# EasyEDA schematic SCH_Orto-Idroponico_2021-09-24.json
TITLE: Orto Idroponico; REV: 2.0; Date: 2021-09-23; Sheet: 1/1; Drawn By: francesco-scar; Company: Fablab Imperia
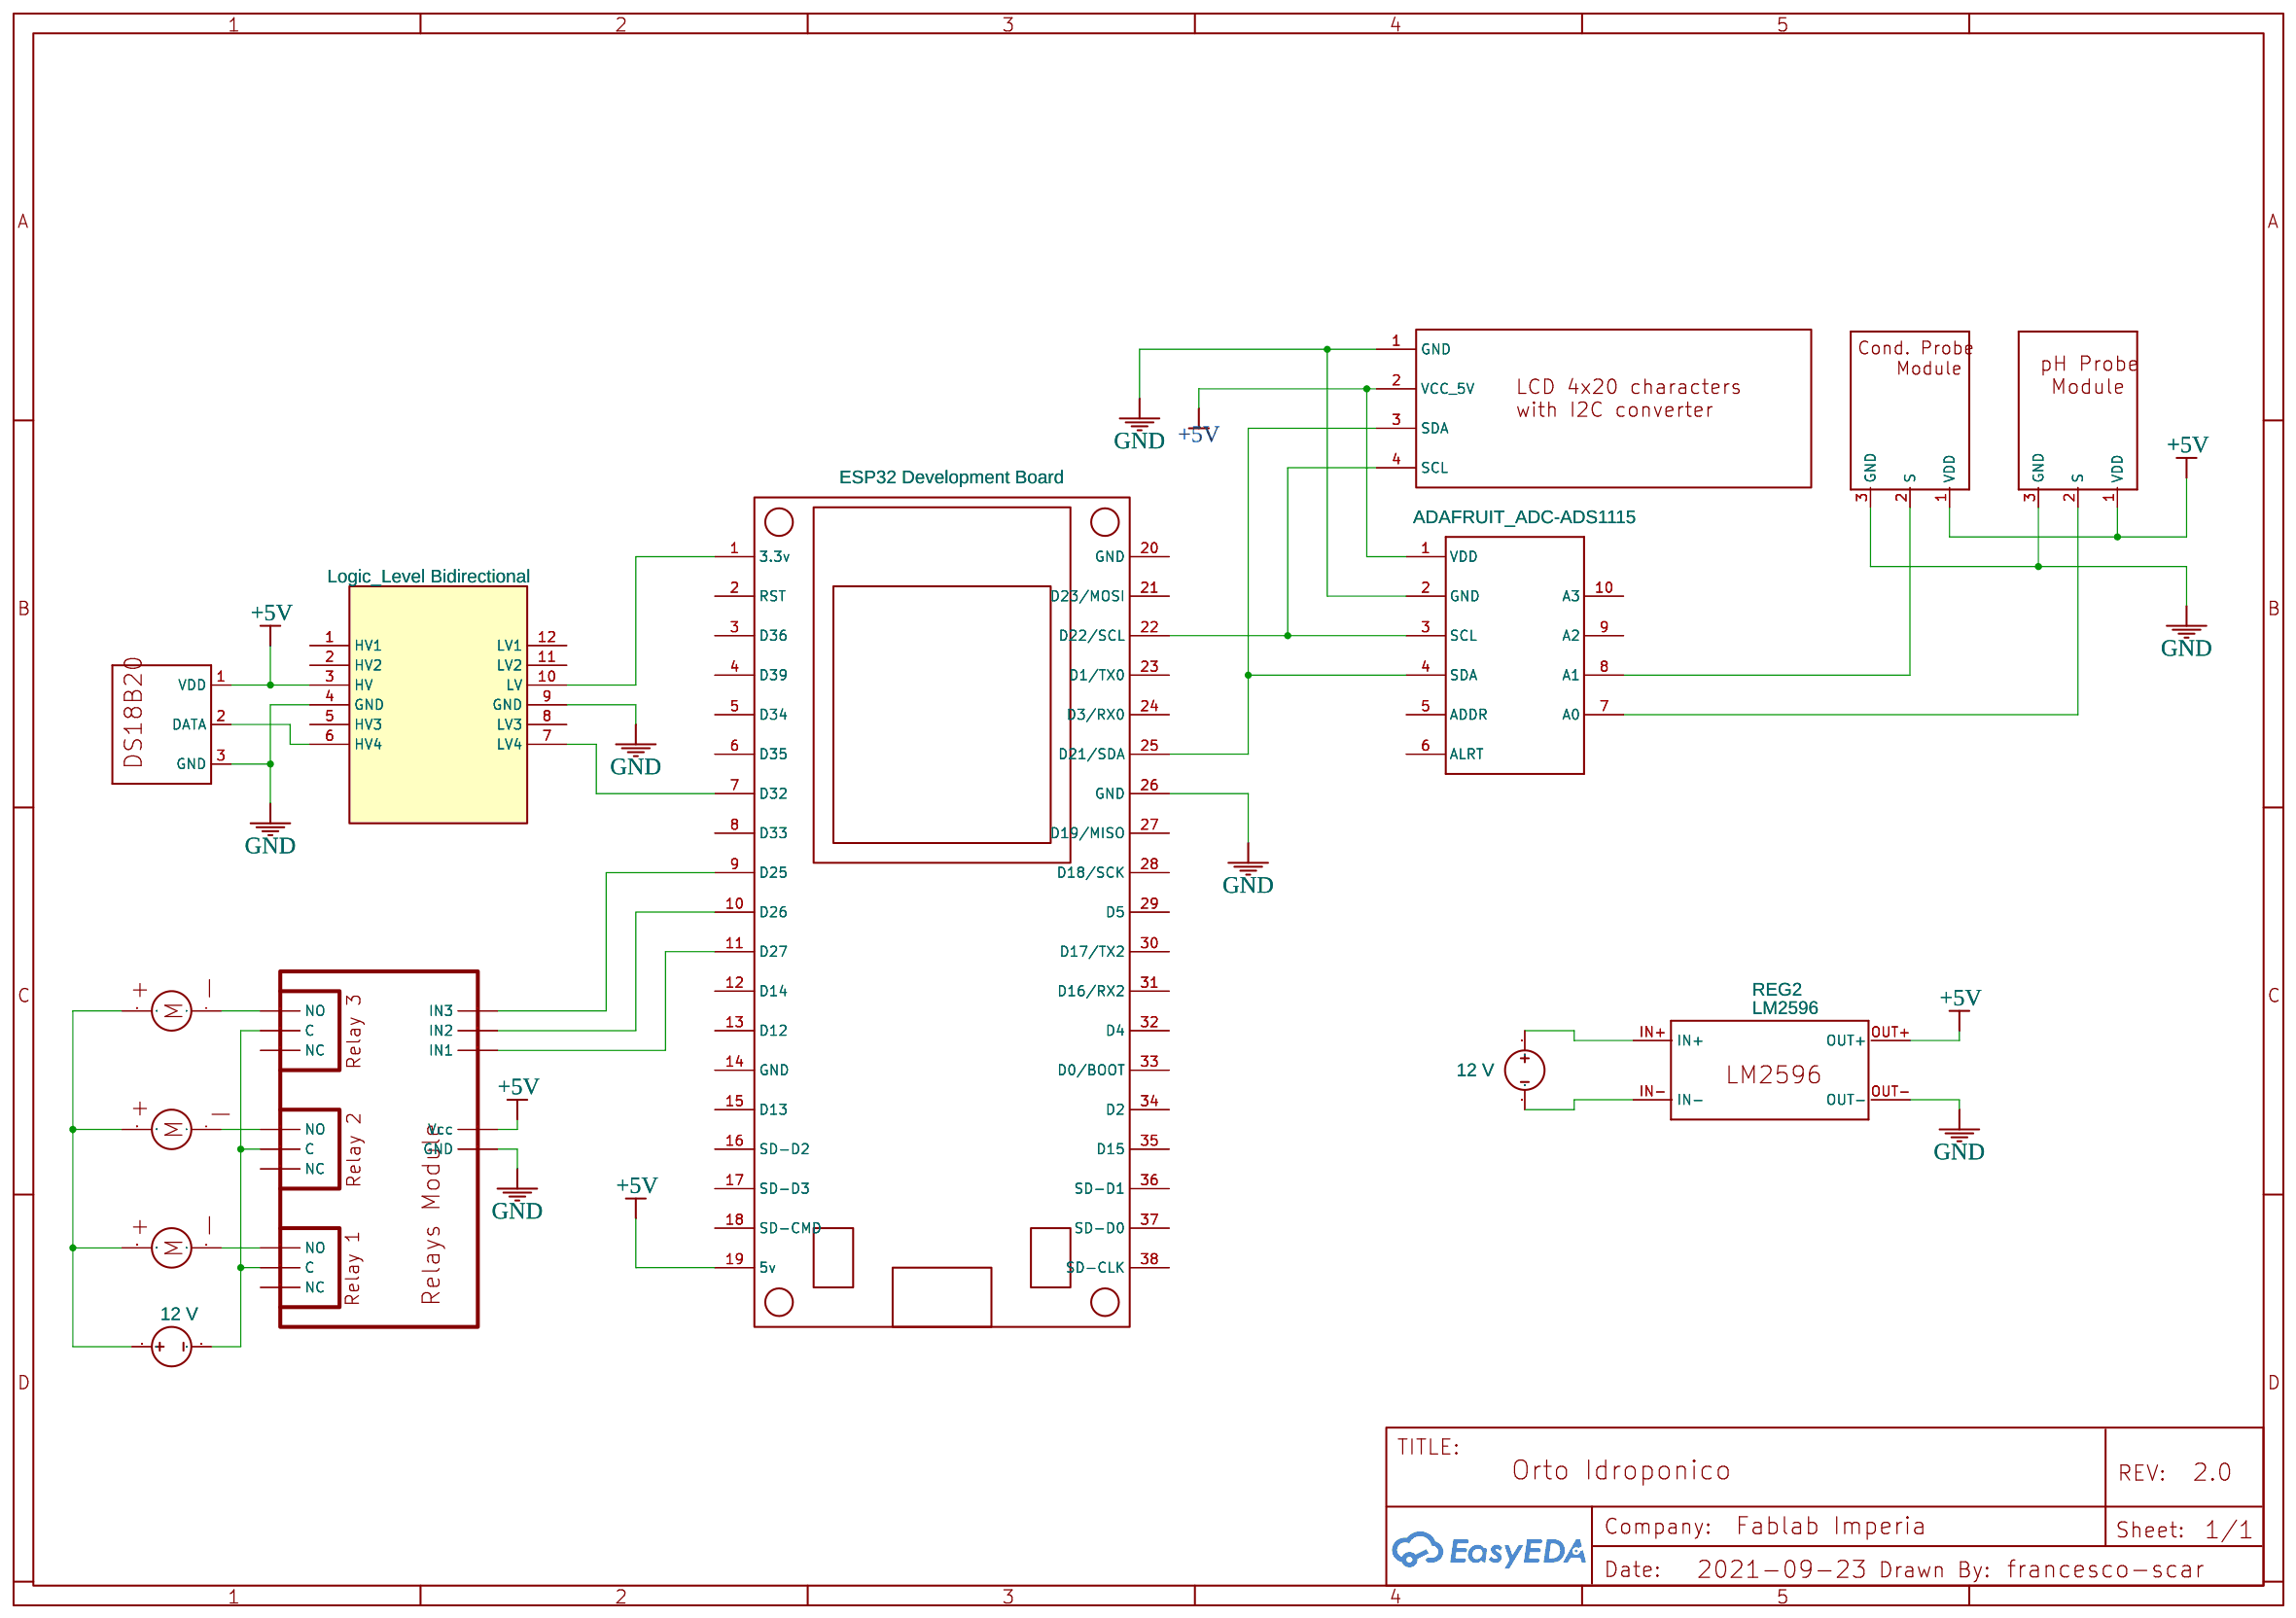
[diagram p0: schematic sheet]

## Parts
2  ADAFRUIT_ADC-ADS1115  [ADAFRUIT_ADC-ADS1015]
P1  Logic_Level Bidirectional  [LOGIC_LEVEL BIDIRECTIONAL]
REG2  LM2596  [LM2596]
T1  DS18B20  [DS18B20]
T2  pH probe module  [DS18B20]
T3  conductivity probe module  [DS18B20]
U1  ESP32 Development Board  [ESP32 DEVELOPMENT BOARD V1]
U2  3_RELAYS_MODULE  [4 RELAY MODULE]
U3  Nettigo LCD 4x20 I2C  [NETTIGO LCD 4X20 I2C]
U4  DC Motor  [TT DC MOTOR]
U5  DC Motor  [TT DC MOTOR]
U6  DC Motor  [TT DC MOTOR]
V1  12 V  [HDR1X2]
V2  12 V  [HDR1X2]

## Library data of the parts
2 = ADAFRUIT_ADC-ADS1115: Contributor: Contributor
P1 = Logic_Level Bidirectional: sourceId: ldJDwO6oi
REG2 = LM2596: Contributor: Kevin Kwok
T1 = DS18B20: Contributor: Contributor
T2 = pH probe module: Contributor: Contributor
T3 = conductivity probe module: Contributor: Contributor
U1 = ESP32 Development Board: Contributor: drfailov
U2 = 3_RELAYS_MODULE: Manufacturer Part: 3 Relays Module; Contributor: Contributor
U3 = Nettigo LCD 4x20 I2C: Manufacturer Part: 2004A; link: https://nettigo.eu/products/lcd-4x20-i2c-blue; Contributor: irukard
U4-U6 = DC Motor: Contributor: MARTINbucke
V1 V2 = DC Power Source: Contributor: usauter

## Nets
+5V: 2.1(VDD) P1.3(HV) REG2.OUT+ T1.1(VDD) T2.1(VDD) T3.1(VDD) U1.19(5v) U2.5(Vcc) U3.2(VCC 5V)
GND: 2.2(GND) P1.4(GND) P1.9(GND) REG2.OUT- T1.3(GND) T2.3(GND) T3.3(GND) U1.26(GND) U2.1(GND) U3.1(GND)
Net-(2-3): 2.3(SCL) U1.22(D22/SCL) U3.4(SCL)
Net-(2-4): 2.4(SDA) U1.25(D21/SDA) U3.3(SDA)
Net-(2-7): 2.7(A0) T2.2(S)
Net-(2-8): 2.8(A1) T3.2(S)
Net-(P1-6): P1.6(HV4) T1.2(DATA)
Net-(P1-7): P1.7(LV4) U1.7(D32)
Net-(P1-10): P1.10(LV) U1.1(3.3v)
Net-(REG2-IN+): REG2.IN+ V1.1
Net-(REG2-IN-): REG2.IN- V1.2
Net-(U1-9): U1.9(D25) U2.4(IN3)
Net-(U1-10): U1.10(D26) U2.3(IN2)
Net-(U1-11): U1.11(D27) U2.2(IN1)
Net-(U2-10): U2.10(C) U2.13(C) U2.16(C) V2.2
Net-(U2-11): U2.11(NO) U6.1
Net-(U2-14): U2.14(NO) U5.1
Net-(U2-17): U2.17(NO) U4.1
Net-(U4-2): U4.2 U5.2 U6.2 V2.1

Not connected (* = marked no-connect by the designer): 2 5(ADDR) 6(ALRT) 9(A2) 10(A3); P1 1(HV1) 2(HV2) 5(HV3) 8(LV3) 11(LV2) 12(LV1); U1 2(RST) 3(D36) 4(D39) 5(D34) 6(D35) 8(D33) 12(D14) 13(D12) 14(GND) 15(D13) 16(SD-D2) 17(SD-D3) 18(SD-CMD) 20(GND) 21(D23/MOSI) 23(D1/TX0) 24(D3/RX0) 27(D19/MISO) 28(D18/SCK) 29(D5) 30(D17/TX2) 31(D16/RX2) 32(D4) 33(D0/BOOT) 34(D2) 35(D15) 36(SD-D1) 37(SD-D0) 38(SD-CLK); U2 9(NC) 12(NC) 15(NC)
